# Altium project RELAY_MODULE.PrjPCB
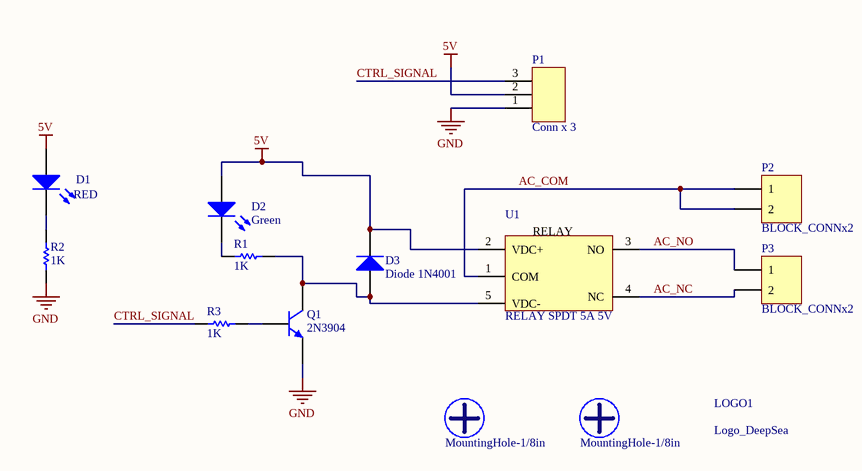
[diagram p0: RELAY_MODULE.SchDoc]
1 sheet, 14 parts. Net scope: global (net labels, ports and power ports of the same name join across sheets).
Board file: RELAY_MODULE.PcbDoc

## Sheet RELAY_MODULE.SchDoc
size A4

### Parts
D1  RED  [R0603_L]
D2  Green  [R0603_L]
D3  Diode 1N4001  [DO-41]
LOGO1  Logo_DeepSea  [DeepSea_logo1]
M1  MountingHole-1/8in  [MoutingHole-1/8in]
M2  MountingHole-1/8in  [MoutingHole-1/8in]
P1  Conn x 3  [conn x 3]
P2  BLOCK_CONNx2  [BLOCK_CONNX2]
P3  BLOCK_CONNx2  [BLOCK_CONNX2]
Q1  2N3904  [TO-92A]
R1  value 1K  [R0603_L]  (hidden comment: R_SMD)
R2  value 1K  [R0603_L]  (hidden comment: R_SMD)
R3  value 1K  [R0603_L]  (hidden comment: R_SMD)
U1  RELAY SPDT 5A 5V  [RELAY]

### Nets
5V: D1.1(A) D2.1(A) D3.2(K) P1.2 U1.2(VDC+)
GND: P1.1 Q1.1(E) R2.2
AC_COM: P2.1 P2.2 U1.1(COM)
AC_NC: P3.2 U1.4(NC)
AC_NO: P3.1 U1.3(NO)
CTRL_SIGNAL: P1.3 R3.2
NetD1_2: D1.2(K) R2.1
NetD2_2: D2.2(K) R1.2
NetD3_1: D3.1(A) Q1.3(C) R1.1 U1.5(VDC-)
NetQ1_2: Q1.2(B) R3.1

### Notes on the sheet
- (in symbol RELAY SPDT 5A 5V) RELAY

### Library data of the parts
D1 D2 = LED_SMD
  D1: Color: RED
  D2: Color: Green
D3 = Diode 1N4001: 1 Amp General Purpose Rectifier; Published: 8-Jun-2000; LatestRevisionDate: 17-Jul-2002; LatestRevisionNote: Re-released for DXP Platform.; DatasheetVersion: 1998; PackageVersion: Aug-1999; PackageReference: DO-41; Publisher: Altium Limited; PackageDescription: Diode, Axial; Body 5.2 x 2.7 mm (LxDia. max), Lead Dia. 0.86 mm (max); Code_JEDEC: DO-204-AL; ComponentLink1Description: Manufacturer Link; ComponentLink1URL: http://www.fairchildsemi.com/; ComponentLink2Description: Datasheet; ComponentLink2URL: http://www.fairchildsemi.com/ds/1N%2F1N4001.pdf
P1 = Conn x 3: CONN HEADER VERT 3POS .100 TIN; Manufacturer: TE Connectivity; Manufacturer Part Number: 640456-3; Connector Type: Header, Unshrouded; Number of Positions: 3; Number of Positions Loaded: All; Pitch: 0.100" (2.54mm); Supplier 1: Digi-Key; RoHS: RoHS Compliant; Category: Connectors, Interconnects; Stock 1: 62912; Pricing 1: 1=0.2, 10=0.185, 50=0.118, 100=0.1141, 250=0.09832, 500=0.0944, 1000=0.08259, 2500=0.07473, 5000=0.07079 (USD); Packaging: Bulk; Contact Type: Male Pin; Number of Rows: 1; Row Spacing: -; Contact Mating Length: 0.295" (7.49mm); Mounting Type: Through Hole; Termination: Solder; Fastening Type: Friction Lock; Features: -; Contact Finish: Tin; Contact Finish Thickness: -; Color: Natural; ComponentLink1URL: http://www.te.com/commerce/DocumentDelivery/DDEController?Action=srchrtrv&DocNm=640456&DocType=Customer+Drawing&DocLang=English; ComponentLink1Description: http://www.te.com/commerce/DocumentDelivery/DDEController?Action=srchrtrv&DocNm=640456&DocType=Customer+Drawing&DocLang=English; Supplier Part Number 1: A19470-ND
P2 P3 = BLOCK_CONNx2: TERM BLOCK 5.08MM VERT 2POS PCB; Manufacturer: On Shore Technology Inc; Manufacturer Part Number: OSTTC022162; Number of Levels: 1; Positions Per Level: 2; Pitch: 0.200" (5.08mm); Mating Orientation: Horizontal with Board; Current: 15A; Voltage: 300V; Wire Gauge: 14-22 AWG; Wire Termination: Screw - Leaf Spring, Wire Guard; Clamp Material - Plating: Steel, Stainless; Screw Material - Plating: Steel - Zinc Plated; Torque - Screw: 0.3 Nm (2.6 Lb-In); Screw Thread: M2.6; Supplier 1: Digi-Key; RoHS: RoHS Compliant; Category: Connectors, Interconnects; Stock 1: 37906; Pricing 1: 1=0.41, 10=0.385, 50=0.2806, 100=0.2695, 250=0.242, 500=0.231, 1000=0.1925, 2500=0.176, 5000=0.165 (USD); Packaging: Bulk; Mounting Type: Through Hole; Features: Interlocking (Side); Color: Blue; Operating Temperature: -30°C ~ 105°C; Housing Material: Thermoplastic; Contact Material - Plating: Tin Plated; ComponentLink1URL: http://www.on-shore.com/sites/default/files/manuals/osttcxx2162.pdf; ComponentLink1Description: http://www.on-shore.com/sites/default/files/manuals/osttcxx2162.pdf; Supplier Part Number 1: ED2609-ND
Q1 = 2N3904: NPN General Purpose Amplifier; Published: 8-Jun-2000; LatestRevisionDate: 15-Jan-2003; LatestRevisionNote: PCB Footprint 'BCY-W3/D4.7' replaced; DatasheetVersion: 1997; PackageVersion: Sep-1998; PackageReference: TO-92A; Publisher: Altium Limited; PackageDescription: TO, Flat Index; 3 In-Line, Axial Leads; Body Dia. 4.5mm; Leads 0.51 x 0.48 mm (max); ComponentLink1Description: Manufacturer Link; ComponentLink1URL: http://www.fairchildsemi.com/; ComponentLink2Description: Datasheet; ComponentLink2URL: http://www.fairchildsemi.com/ds/2N%2F2N3904.pdf
U1 = RELAY SPDT 5A 5V: RELAY GENERAL PURPOSE SPDT 5A 5V; Manufacturer: Omron Electronics Inc-EMC Div; Manufacturer Part Number: G5LA-14 DC5; Coil Type: Non Latching; Coil Current: 72mA; Coil Voltage: 5VDC; Contact Form: SPDT (1 Form C); Switching Voltage: 250VAC, 24VDC - Max; Turn On Voltage (Max): 3.75 VDC; Turn Off Voltage (Min): 0.5 VDC; Operate Time: 10ms; Release Time: 5ms; Coil Power: 360 mW; Coil Resistance: 69 Ohms; Supplier 1: Digi-Key; RoHS: RoHS Compliant; Category: Relays; Stock 1: 2963; Pricing 1: 1=1.39, 10=1.302, 25=1.1576, 50=1.0998, 100=1.0419, 250=0.92616, 500=0.8683, 1000=0.8104, 2500=0.79593 (USD); Packaging: Bulk; Relay Type: General Purpose; Contact Rating (Current): 5A; Features: Insulation - Class A, Sealed - Fully; Mounting Type: Through Hole; Termination Style: PC Pin; Contact Material: Silver Tin Oxide (AgSnO); Operating Temperature: -40°C ~ 85°C; ComponentLink1URL: http://components.omron.com/components/web/PDFLIB.nsf/0/4F7D9D9CA026C97E862573930070AC4F/$file/G5LA_E_0911.pdf; ComponentLink1Description: http://components.omron.com/components/web/PDFLIB.nsf/0/4F7D9D9CA026C97E862573930070AC4F/$file/G5LA_E_0911.pdf; Supplier Part Number 1: Z2560-ND